# EAGLE schematic Schaltplan (EAGLE 9.5.2)
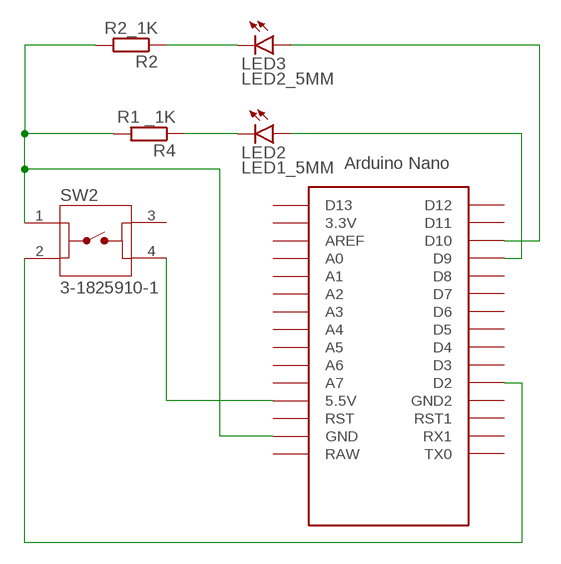
[diagram p0: schematic, sheet 1]

## Parts
LED2  LED1_5MM  LAP4-TOP  [P47F-TOP]
LED3  LED2_5MM  LAP4-TOP  [P47F-TOP]
R2  R2_1K  R-EU_0207/12  [0207/12]
R4  R1 _1K  R-EU_0207/12  [0207/12]
SW2  3-1825910-1  [TE_3-1825910-1]
U$1  NANO  [NANO]

## Nets
N$1: LED2.A U$1.D9
N$2: LED3.A U$1.D10
N$3: LED3.C R2.1
N$4: LED2.C R4.1
N$5: R2.2 R4.2 SW2.1 U$1.GND
N$6: SW2.2 U$1.D2
N$7: SW2.4 U$1.5V(5.5V)
Unconnected: SW2.3 U$1.3.3V U$1.A0 U$1.A1 U$1.A2 U$1.A3 U$1.A4 U$1.A5 U$1.A6 U$1.A7 U$1.AREF U$1.D3 U$1.D4 U$1.D5 U$1.D6 U$1.D7 U$1.D8 U$1.D11 U$1.D12 U$1.D13 U$1.GND1(GND2) U$1.ICSP1 U$1.ICSP2 U$1.ICSP3 U$1.ICSP4 U$1.ICSP5 U$1.ICSP6 U$1.RAW U$1.RST U$1.RST1 U$1.RX1 U$1.TX0

## Library data of the parts
LED2 LED3 = led:*P4: PointLED® Enhanced Thinfilm LED TOP & BOTTOM mount LS P47F, LR P47F, LA P47F, LY P47F, LT P4SG, LB P4SG, LW P4SG Source: http://catalog.osram-os.com .. LA_LR_LS_LY_P47F_Pb_free.pdf
R2 R4 = rcl:R-EU_: RESISTOR, European symbol; SPICEPREFIX: R
SW2 = Press button:3-1825910-1: Switch Tactile OFF (ON) SPST Round Button PC Pins 0.05A 24VDC 100000Cycles 1.57N Thru-Hole Loose; AVAILABILITY: Unavailable; COMMENT: 3-1825910-1; DESCRIPTION: Switch Push Button OFF _ON_ SPST Round Button 0.05A 24VDC Momentary Contact PC Pins Thru-Hole; EU_ROHS_COMPLIANCE: Compliant; MF: TE Connectivity; MP: 3-1825910-1; PACKAGE: None; PRICE: None; TE_PURCHASE_URL: https://www.te.com/usa-en/product-3-1825910-1.html?te_bu=Cor&te_type=disp&te_campaign=seda_glo_cor-seda-global-disp-prtnr-fy19-seda-model-bom-cta_sma-317_1&elqCampaignId=32493
U$1 = Arduino-clone:NANO: Arduino Nano